# EAGLE schematic line-sensor-r2-var1a (EAGLE 9.3.1)
Assembly variants: I2C, USART, SPI

## Sheet 1 of 4
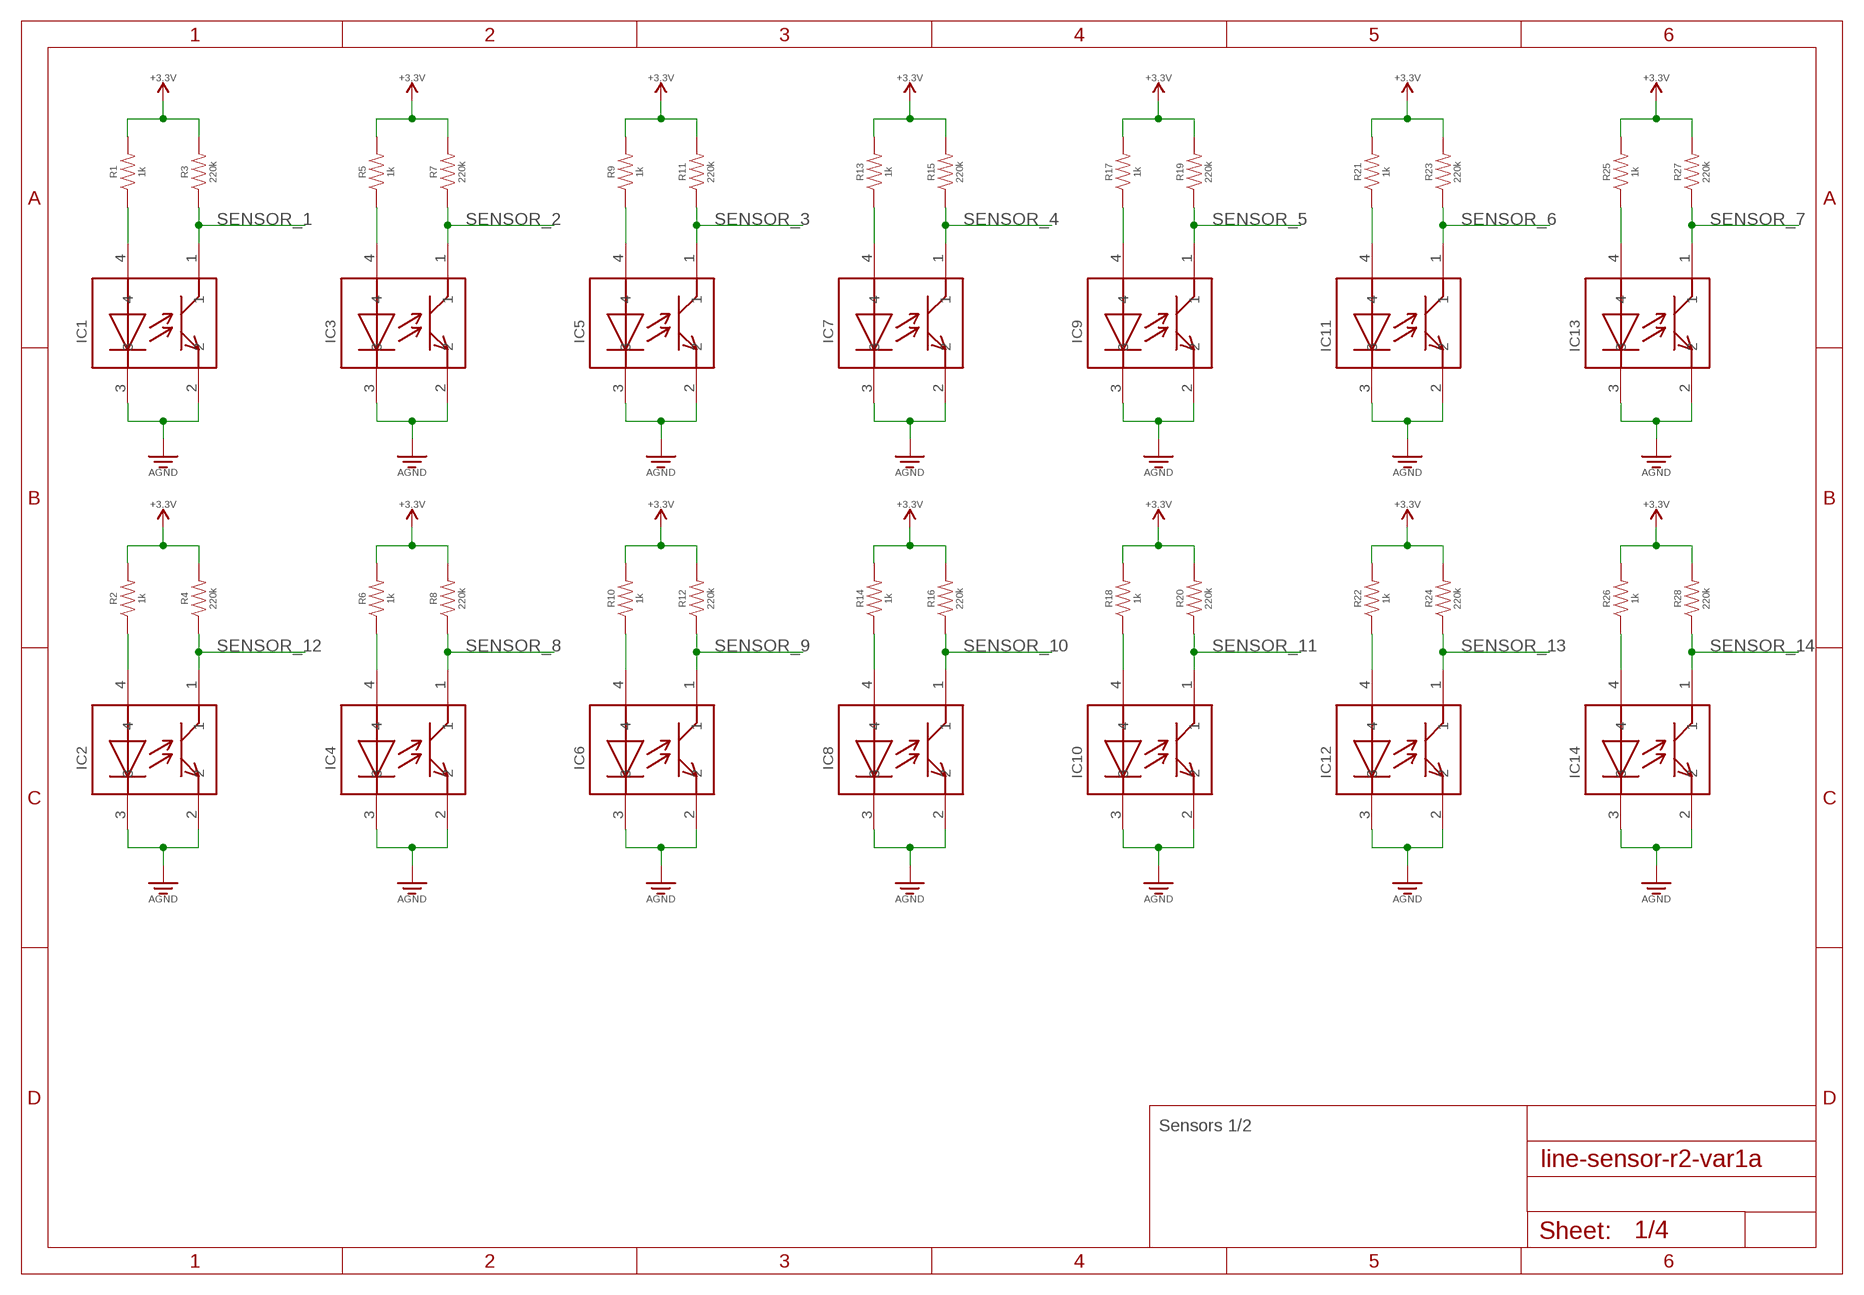
[diagram p0: schematic, sheet 1]

### Parts
IC1  GP2S60  [GP2S60]
IC2  GP2S60  [GP2S60]
IC3  GP2S60  [GP2S60]
IC4  GP2S60  [GP2S60]
IC5  GP2S60  [GP2S60]
IC6  GP2S60  [GP2S60]
IC7  GP2S60  [GP2S60]
IC8  GP2S60  [GP2S60]
IC9  GP2S60  [GP2S60]
IC10  GP2S60  [GP2S60]
IC11  GP2S60  [GP2S60]
IC12  GP2S60  [GP2S60]
IC13  GP2S60  [GP2S60]
IC14  GP2S60  [GP2S60]
R1  1k  RESISTOR_0.1W  [RESISTOR-0603]
R2  1k  RESISTOR_0.1W  [RESISTOR-0603]
R3  220k  RESISTOR_0.1W  [RESISTOR-0603]
R4  220k  RESISTOR_0.1W  [RESISTOR-0603]
R5  1k  RESISTOR_0.1W  [RESISTOR-0603]
R6  1k  RESISTOR_0.1W  [RESISTOR-0603]
R7  220k  RESISTOR_0.1W  [RESISTOR-0603]
R8  220k  RESISTOR_0.1W  [RESISTOR-0603]
R9  1k  RESISTOR_0.1W  [RESISTOR-0603]
R10  1k  RESISTOR_0.1W  [RESISTOR-0603]
R11  220k  RESISTOR_0.1W  [RESISTOR-0603]
R12  220k  RESISTOR_0.1W  [RESISTOR-0603]
R13  1k  RESISTOR_0.1W  [RESISTOR-0603]
R14  1k  RESISTOR_0.1W  [RESISTOR-0603]
R15  220k  RESISTOR_0.1W  [RESISTOR-0603]
R16  220k  RESISTOR_0.1W  [RESISTOR-0603]
R17  1k  RESISTOR_0.1W  [RESISTOR-0603]
R18  1k  RESISTOR_0.1W  [RESISTOR-0603]
R19  220k  RESISTOR_0.1W  [RESISTOR-0603]
R20  220k  RESISTOR_0.1W  [RESISTOR-0603]
R21  1k  RESISTOR_0.1W  [RESISTOR-0603]
R22  1k  RESISTOR_0.1W  [RESISTOR-0603]
R23  220k  RESISTOR_0.1W  [RESISTOR-0603]
R24  220k  RESISTOR_0.1W  [RESISTOR-0603]
R25  1k  RESISTOR_0.1W  [RESISTOR-0603]
R26  1k  RESISTOR_0.1W  [RESISTOR-0603]
R27  220k  RESISTOR_0.1W  [RESISTOR-0603]
R28  220k  RESISTOR_0.1W  [RESISTOR-0603]
SUPPLY1  +3.3V  (no package)
SUPPLY2  +3.3V  (no package)
SUPPLY3  +3.3V  (no package)
SUPPLY4  +3.3V  (no package)
SUPPLY5  +3.3V  (no package)
SUPPLY6  +3.3V  (no package)
SUPPLY7  +3.3V  (no package)
SUPPLY8  +3.3V  (no package)
SUPPLY9  +3.3V  (no package)
SUPPLY10  +3.3V  (no package)
SUPPLY11  +3.3V  (no package)
SUPPLY12  +3.3V  (no package)
SUPPLY13  +3.3V  (no package)
SUPPLY14  +3.3V  (no package)

### Nets
GND: IC1.2 IC1.3 IC2.2 IC2.3 IC3.2 IC3.3 IC4.2 IC4.3 IC5.2 IC5.3 IC6.2 IC6.3 IC7.2 IC7.3 IC8.2 IC8.3 IC9.2 IC9.3 IC10.2 IC10.3 IC11.2 IC11.3 IC12.2 IC12.3 IC13.2 IC13.3 IC14.2 IC14.3 ; supply symbol labelled AGND ; also sheet 2,3,4
N$1: IC3.4 R5.P$1
N$2: IC1.4 R1.P$1
N$3: IC5.4 R9.P$1
N$4: IC7.4 R13.P$1
N$5: IC9.4 R17.P$1
N$6: IC11.4 R21.P$1
N$7: IC13.4 R25.P$1
N$8: IC4.4 R6.P$1
N$9: IC6.4 R10.P$1
N$10: IC8.4 R14.P$1
N$11: IC10.4 R18.P$1
N$12: IC2.4 R2.P$1
N$13: IC12.4 R22.P$1
N$14: IC14.4 R26.P$1
SENSOR_1: IC1.1 R3.P$1 ; also sheet 3
SENSOR_2: IC3.1 R7.P$1 ; also sheet 3
SENSOR_3: IC5.1 R11.P$1 ; also sheet 3
SENSOR_4: IC7.1 R15.P$1 ; also sheet 3
SENSOR_5: IC9.1 R19.P$1 ; also sheet 3
SENSOR_6: IC11.1 R23.P$1 ; also sheet 3
SENSOR_7: IC13.1 R27.P$1 ; also sheet 3
SENSOR_8: IC4.1 R8.P$1 ; also sheet 3
SENSOR_9: IC6.1 R12.P$1 ; also sheet 3
SENSOR_10: IC8.1 R16.P$1 ; also sheet 3
SENSOR_11: IC10.1 R20.P$1 ; also sheet 3
SENSOR_12: IC2.1 R4.P$1 ; also sheet 3
SENSOR_13: IC12.1 R24.P$1 ; also sheet 3
SENSOR_14: IC14.1 R28.P$1 ; also sheet 3
VDD: R1.P$2 R2.P$2 R3.P$2 R4.P$2 R5.P$2 R6.P$2 R7.P$2 R8.P$2 R9.P$2 R10.P$2 R11.P$2 R12.P$2 R13.P$2 R14.P$2 R15.P$2 R16.P$2 R17.P$2 R18.P$2 R19.P$2 R20.P$2 R21.P$2 R22.P$2 R23.P$2 R24.P$2 R25.P$2 R26.P$2 R27.P$2 R28.P$2 SUPPLY1.VCC SUPPLY2.VCC SUPPLY3.VCC SUPPLY4.VCC SUPPLY5.VCC SUPPLY6.VCC SUPPLY7.VCC SUPPLY8.VCC SUPPLY9.VCC SUPPLY10.VCC SUPPLY11.VCC SUPPLY12.VCC SUPPLY13.VCC SUPPLY14.VCC ; also sheet 2,3,4

### Notes on the sheet
- Sensors 1/2

## Sheet 2 of 4
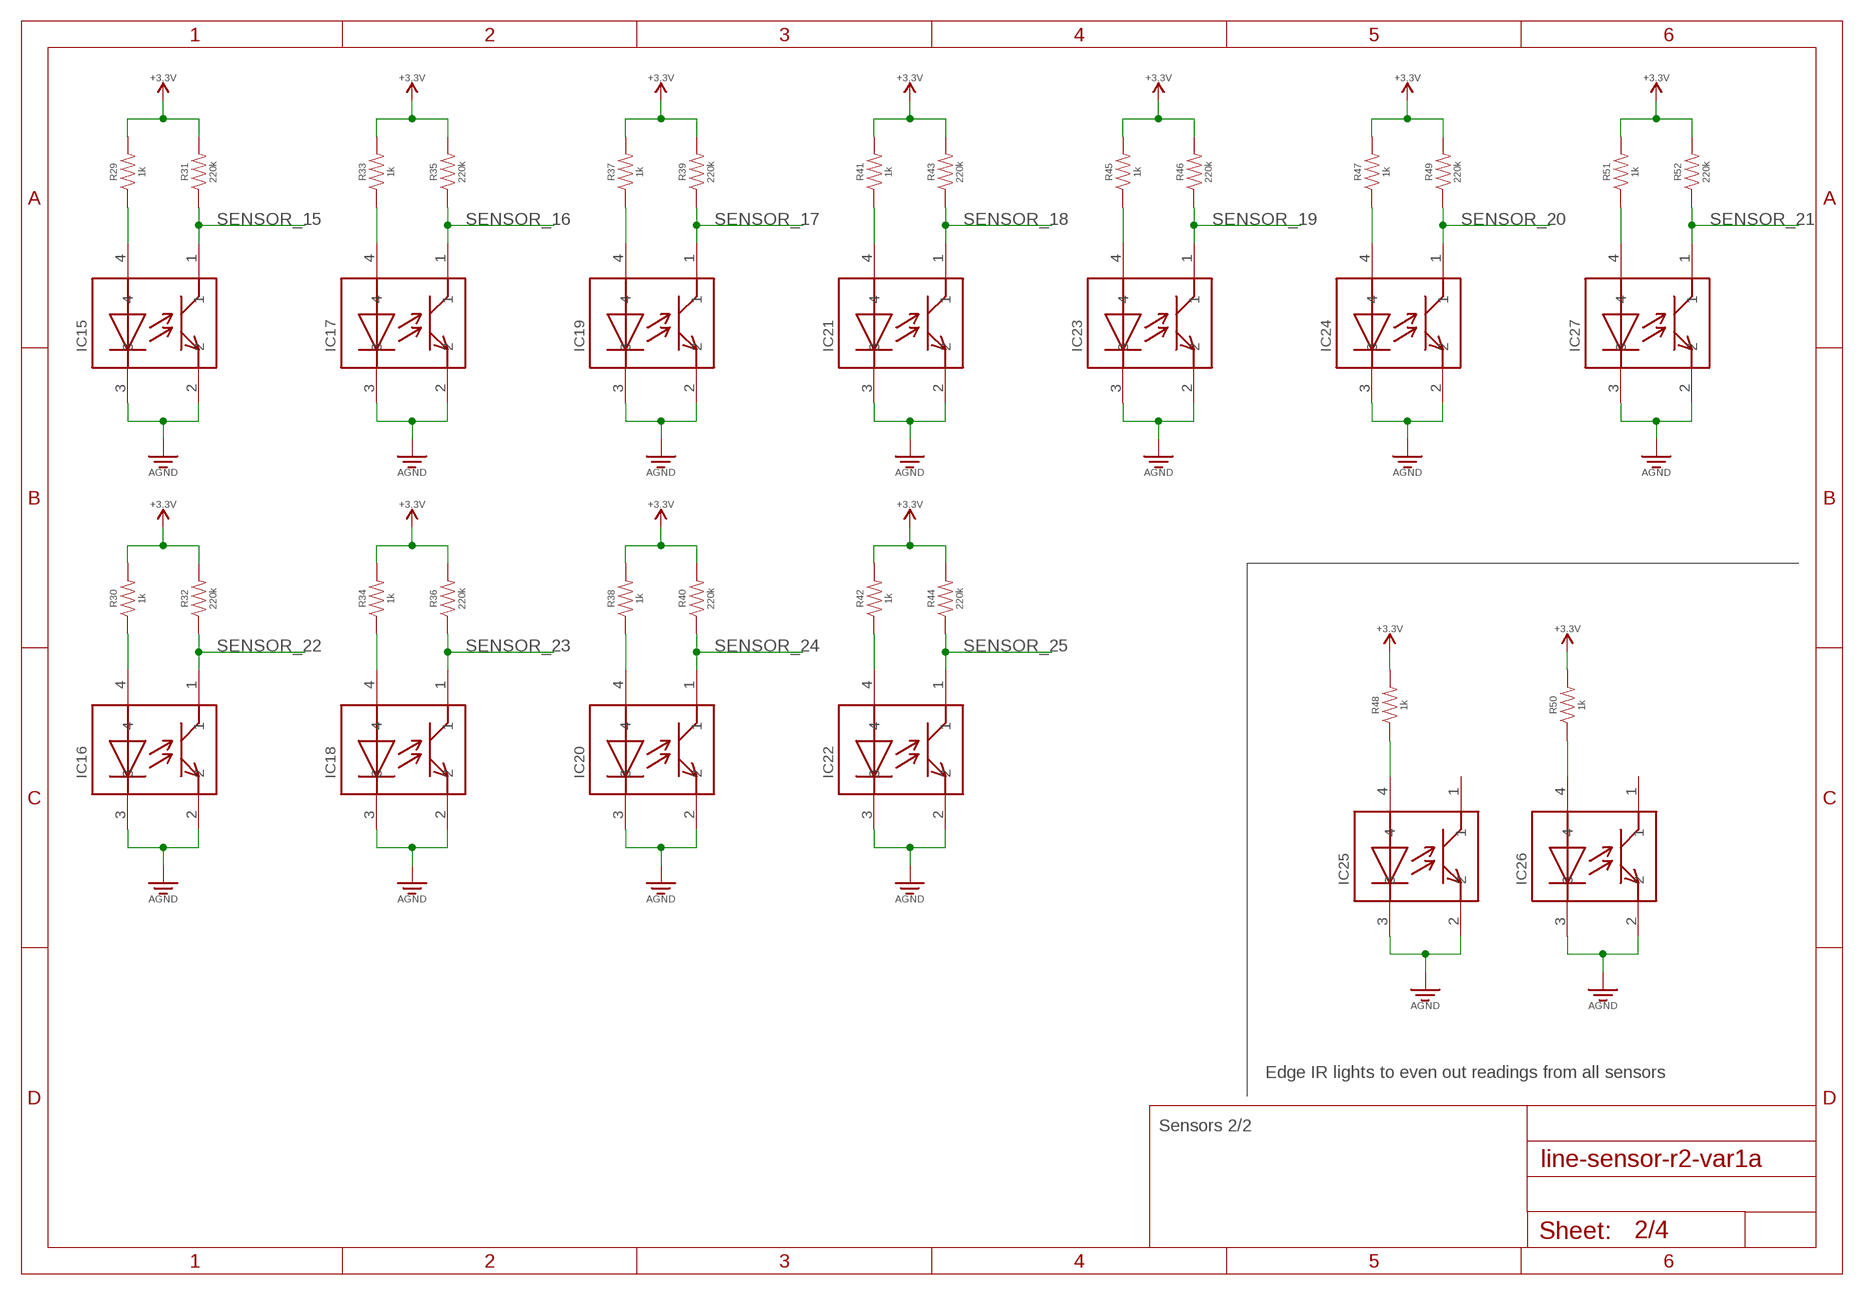
[diagram p1: schematic, sheet 2]

### Parts
IC15  GP2S60  [GP2S60]
IC16  GP2S60  [GP2S60]
IC17  GP2S60  [GP2S60]
IC18  GP2S60  [GP2S60]
IC19  GP2S60  [GP2S60]
IC20  GP2S60  [GP2S60]
IC21  GP2S60  [GP2S60]
IC22  GP2S60  [GP2S60]
IC23  GP2S60  [GP2S60]
IC24  GP2S60  [GP2S60]
IC25  GP2S60  [GP2S60]
IC26  GP2S60  [GP2S60]
IC27  GP2S60  [GP2S60]
R29  1k  RESISTOR_0.1W  [RESISTOR-0603]
R30  1k  RESISTOR_0.1W  [RESISTOR-0603]
R31  220k  RESISTOR_0.1W  [RESISTOR-0603]
R32  220k  RESISTOR_0.1W  [RESISTOR-0603]
R33  1k  RESISTOR_0.1W  [RESISTOR-0603]
R34  1k  RESISTOR_0.1W  [RESISTOR-0603]
R35  220k  RESISTOR_0.1W  [RESISTOR-0603]
R36  220k  RESISTOR_0.1W  [RESISTOR-0603]
R37  1k  RESISTOR_0.1W  [RESISTOR-0603]
R38  1k  RESISTOR_0.1W  [RESISTOR-0603]
R39  220k  RESISTOR_0.1W  [RESISTOR-0603]
R40  220k  RESISTOR_0.1W  [RESISTOR-0603]
R41  1k  RESISTOR_0.1W  [RESISTOR-0603]
R42  1k  RESISTOR_0.1W  [RESISTOR-0603]
R43  220k  RESISTOR_0.1W  [RESISTOR-0603]
R44  220k  RESISTOR_0.1W  [RESISTOR-0603]
R45  1k  RESISTOR_0.1W  [RESISTOR-0603]
R46  220k  RESISTOR_0.1W  [RESISTOR-0603]
R47  1k  RESISTOR_0.1W  [RESISTOR-0603]
R48  1k  RESISTOR_0.1W  [RESISTOR-0603]
R49  220k  RESISTOR_0.1W  [RESISTOR-0603]
R50  1k  RESISTOR_0.1W  [RESISTOR-0603]
R51  1k  RESISTOR_0.1W  [RESISTOR-0603]
R52  220k  RESISTOR_0.1W  [RESISTOR-0603]
SUPPLY15  +3.3V  (no package)
SUPPLY16  +3.3V  (no package)
SUPPLY17  +3.3V  (no package)
SUPPLY18  +3.3V  (no package)
SUPPLY19  +3.3V  (no package)
SUPPLY20  +3.3V  (no package)
SUPPLY21  +3.3V  (no package)
SUPPLY22  +3.3V  (no package)
SUPPLY23  +3.3V  (no package)
SUPPLY24  +3.3V  (no package)
SUPPLY25  +3.3V  (no package)
SUPPLY26  +3.3V  (no package)
SUPPLY27  +3.3V  (no package)

### Nets
GND: IC15.2 IC15.3 IC16.2 IC16.3 IC17.2 IC17.3 IC18.2 IC18.3 IC19.2 IC19.3 IC20.2 IC20.3 IC21.2 IC21.3 IC22.2 IC22.3 IC23.2 IC23.3 IC24.2 IC24.3 IC25.2 IC25.3 IC26.2 IC26.3 IC27.2 IC27.3 ; supply symbol labelled AGND ; also sheet 1,3,4
N$15: IC15.4 R29.P$1
N$16: IC17.4 R33.P$1
N$17: IC19.4 R37.P$1
N$18: IC21.4 R41.P$1
N$19: IC23.4 R45.P$1
N$20: IC24.4 R47.P$1
N$21: IC27.4 R51.P$1
N$22: IC16.4 R30.P$1
N$23: IC18.4 R34.P$1
N$24: IC20.4 R38.P$1
N$25: IC22.4 R42.P$1
N$30: IC26.4 R50.P$1
N$31: IC25.4 R48.P$1
SENSOR_15: IC15.1 R31.P$1 ; also sheet 3
SENSOR_16: IC17.1 R35.P$1 ; also sheet 3
SENSOR_17: IC19.1 R39.P$1 ; also sheet 3
SENSOR_18: IC21.1 R43.P$1 ; also sheet 3
SENSOR_19: IC23.1 R46.P$1 ; also sheet 3
SENSOR_20: IC24.1 R49.P$1 ; also sheet 3
SENSOR_21: IC27.1 R52.P$1 ; also sheet 3
SENSOR_22: IC16.1 R32.P$1 ; also sheet 3
SENSOR_23: IC18.1 R36.P$1 ; also sheet 3
SENSOR_24: IC20.1 R40.P$1 ; also sheet 3
SENSOR_25: IC22.1 R44.P$1 ; also sheet 3
VDD: R29.P$2 R30.P$2 R31.P$2 R32.P$2 R33.P$2 R34.P$2 R35.P$2 R36.P$2 R37.P$2 R38.P$2 R39.P$2 R40.P$2 R41.P$2 R42.P$2 R43.P$2 R44.P$2 R45.P$2 R46.P$2 R47.P$2 R48.P$2 R49.P$2 R50.P$2 R51.P$2 R52.P$2 SUPPLY15.VCC SUPPLY16.VCC SUPPLY17.VCC SUPPLY18.VCC SUPPLY19.VCC SUPPLY20.VCC SUPPLY21.VCC SUPPLY22.VCC SUPPLY23.VCC SUPPLY24.VCC SUPPLY25.VCC SUPPLY26.VCC SUPPLY27.VCC ; also sheet 1,3,4
Unconnected: IC25.1 IC26.1

### Notes on the sheet
- Edge IR lights to even out readings from all sensors
- Sensors 2/2

## Sheet 3 of 4
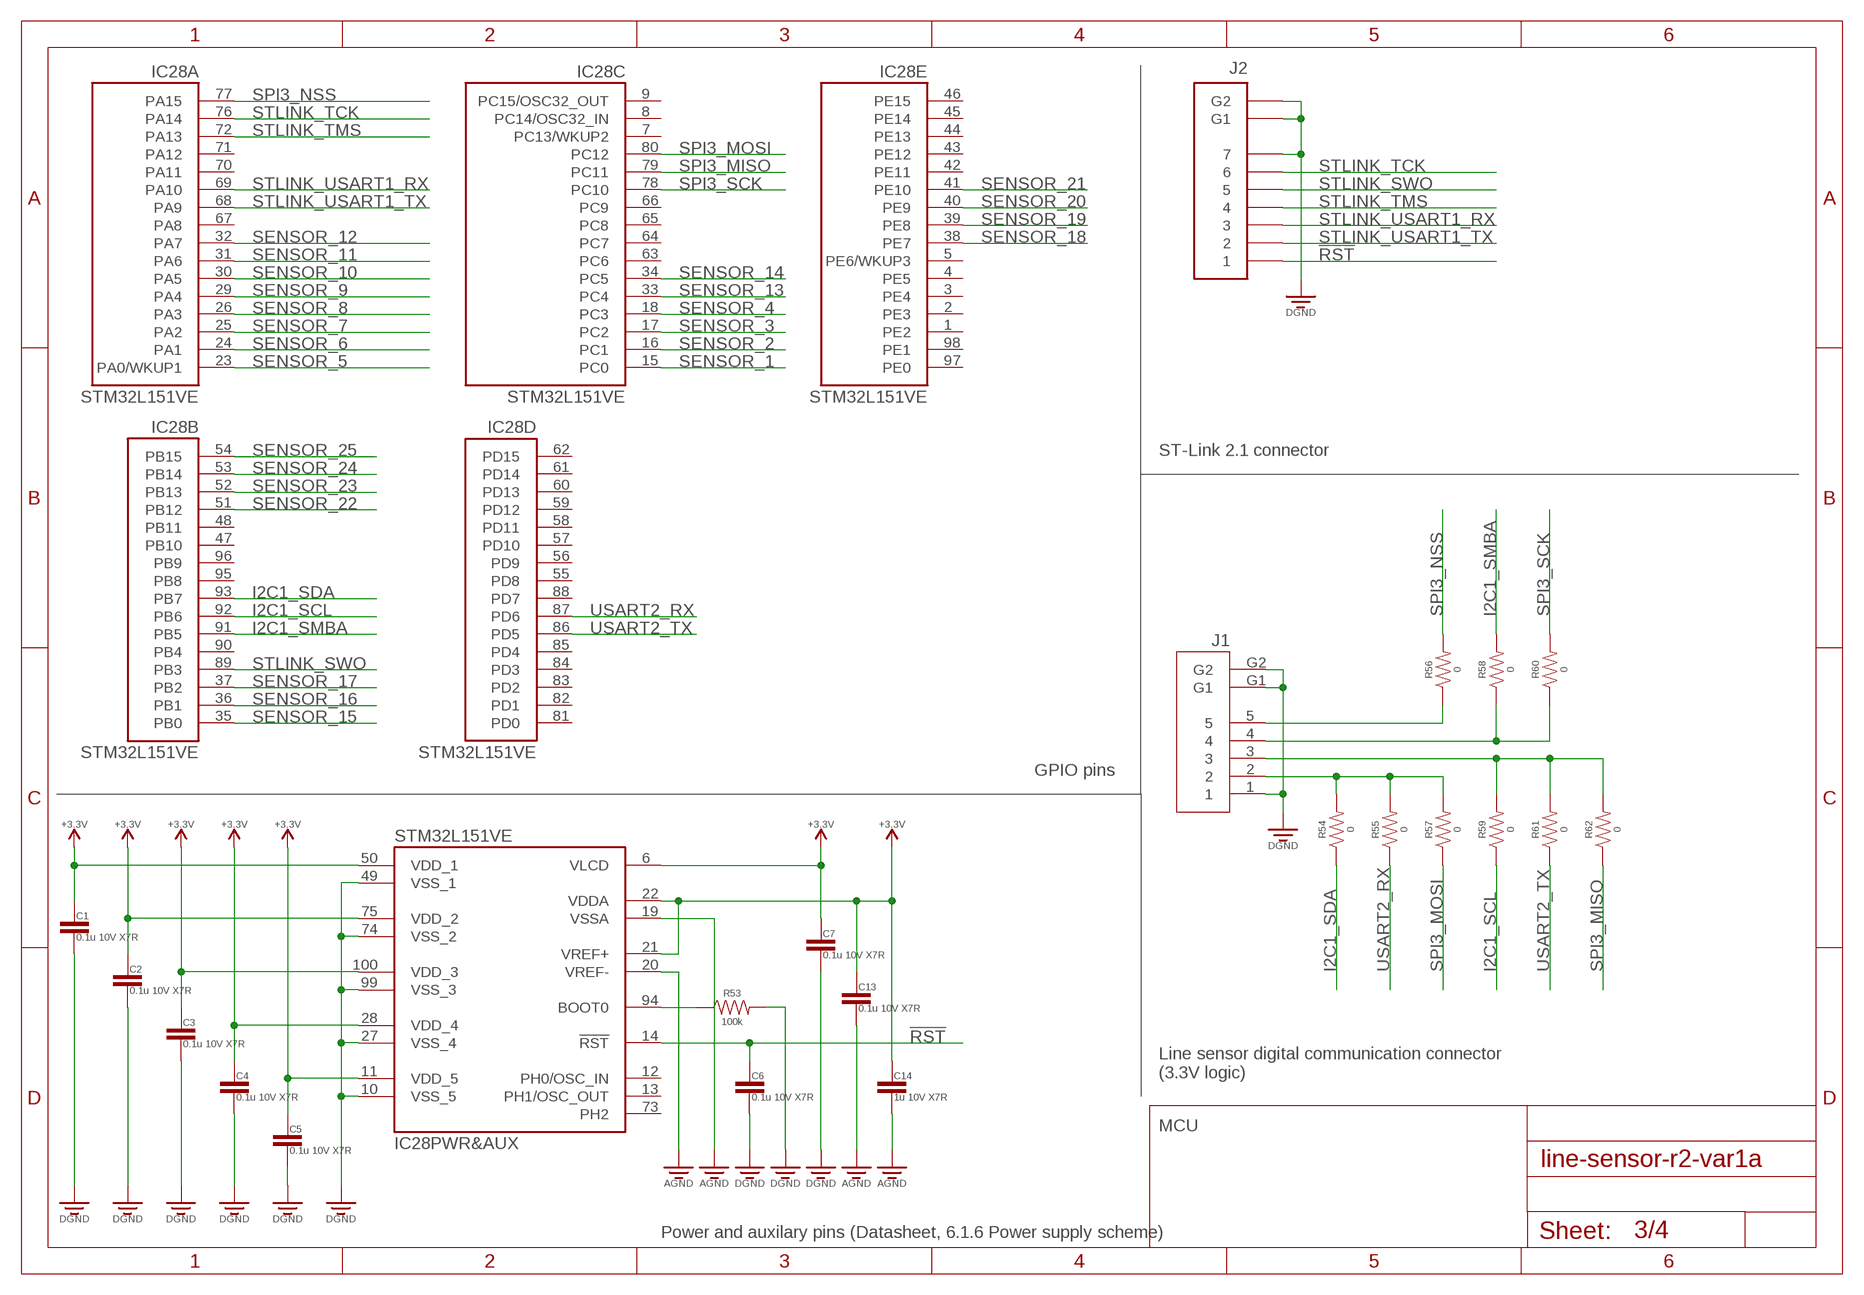
[diagram p2: schematic, sheet 3]

### Parts
C1  0.1u 10V X7R  CAPACITOR0603  [CAPACITOR-0603]
C2  0.1u 10V X7R  CAPACITOR0603  [CAPACITOR-0603]
C3  0.1u 10V X7R  CAPACITOR0603  [CAPACITOR-0603]
C4  0.1u 10V X7R  CAPACITOR0603  [CAPACITOR-0603]
C5  0.1u 10V X7R  CAPACITOR0603  [CAPACITOR-0603]
C6  0.1u 10V X7R  CAPACITOR0603  [CAPACITOR-0603]
C7  0.1u 10V X7R  CAPACITOR0603  [CAPACITOR-0603]
C13  0.1u 10V X7R  CAPACITOR0603  [CAPACITOR-0603]
C14  1u 10V X7R  CAPACITOR0603  [CAPACITOR-0603]
IC28  STM32L151VE  [LQFP100_14X14]
J1  MOLEX-502382-05XX  [MOLEX-502382-05XX]
J2  MOLEX-53261-0771  [MOLEX-53261-0771]
R53  100k  RESISTOR_0.1W  [RESISTOR-0603]
R54  0  RESISTOR_0.1W  [RESISTOR-0603]  (not fitted in variant USART)  (not fitted in variant SPI)
R55  0  RESISTOR_0.1W  [RESISTOR-0603]  (not fitted in variant I2C)  (not fitted in variant SPI)
R56  0  RESISTOR_0.1W  [RESISTOR-0603]  (not fitted in variant I2C)  (not fitted in variant USART)
R57  0  RESISTOR_0.1W  [RESISTOR-0603]  (not fitted in variant I2C)  (not fitted in variant USART)
R58  0  RESISTOR_0.1W  [RESISTOR-0603]  (not fitted in variant USART)  (not fitted in variant SPI)
R59  0  RESISTOR_0.1W  [RESISTOR-0603]  (not fitted in variant USART)  (not fitted in variant SPI)
R60  0  RESISTOR_0.1W  [RESISTOR-0603]  (not fitted in variant I2C)  (not fitted in variant USART)
R61  0  RESISTOR_0.1W  [RESISTOR-0603]  (not fitted in variant I2C)  (not fitted in variant SPI)
R62  0  RESISTOR_0.1W  [RESISTOR-0603]  (not fitted in variant I2C)  (not fitted in variant USART)
SUPPLY28  +3.3V  (no package)
SUPPLY29  +3.3V  (no package)
SUPPLY30  +3.3V  (no package)
SUPPLY31  +3.3V  (no package)
SUPPLY32  +3.3V  (no package)
SUPPLY33  +3.3V  (no package)
SUPPLY37  +3.3V  (no package)

### Nets
!RST: C6.1 IC28.14(PWR&AUX:!RST!) J2.1
BOOT0: IC28.94(PWR&AUX:BOOT0) R53.P$1
GND: C1.2 C2.2 C3.2 C4.2 C5.2 C6.2 C7.2 C13.2 C14.2 IC28.10(PWR&AUX:VSS_5) IC28.19(PWR&AUX:VSSA) IC28.20(PWR&AUX:VREF-) IC28.27(PWR&AUX:VSS_4) IC28.49(PWR&AUX:VSS_1) IC28.74(PWR&AUX:VSS_2) IC28.99(PWR&AUX:VSS_3) J1.1 J1.G1 J1.G2 J2.7 J2.G1 J2.G2 R53.P$2 ; supply symbol labelled DGND, AGND ; also sheet 1,2,4
I2C1_SCL: IC28.92(B:PB6) R59.P$1
I2C1_SDA: IC28.93(B:PB7) R54.P$1
I2C1_SMBA: IC28.91(B:PB5) R58.P$2
N$26: J1.2 R54.P$2 R55.P$2 R57.P$2
N$27: J1.3 R59.P$2 R61.P$2 R62.P$2
N$28: J1.4 R58.P$1 R60.P$1
N$29: J1.5 R56.P$1
SENSOR_1: IC28.15(C:PC0) ; also sheet 1
SENSOR_2: IC28.16(C:PC1) ; also sheet 1
SENSOR_3: IC28.17(C:PC2) ; also sheet 1
SENSOR_4: IC28.18(C:PC3) ; also sheet 1
SENSOR_5: IC28.23(A:PA0/WKUP1) ; also sheet 1
SENSOR_6: IC28.24(A:PA1) ; also sheet 1
SENSOR_7: IC28.25(A:PA2) ; also sheet 1
SENSOR_8: IC28.26(A:PA3) ; also sheet 1
SENSOR_9: IC28.29(A:PA4) ; also sheet 1
SENSOR_10: IC28.30(A:PA5) ; also sheet 1
SENSOR_11: IC28.31(A:PA6) ; also sheet 1
SENSOR_12: IC28.32(A:PA7) ; also sheet 1
SENSOR_13: IC28.33(C:PC4) ; also sheet 1
SENSOR_14: IC28.34(C:PC5) ; also sheet 1
SENSOR_15: IC28.35(B:PB0) ; also sheet 2
SENSOR_16: IC28.36(B:PB1) ; also sheet 2
SENSOR_17: IC28.37(B:PB2) ; also sheet 2
SENSOR_18: IC28.38(E:PE7) ; also sheet 2
SENSOR_19: IC28.39(E:PE8) ; also sheet 2
SENSOR_20: IC28.40(E:PE9) ; also sheet 2
SENSOR_21: IC28.41(E:PE10) ; also sheet 2
SENSOR_22: IC28.51(B:PB12) ; also sheet 2
SENSOR_23: IC28.52(B:PB13) ; also sheet 2
SENSOR_24: IC28.53(B:PB14) ; also sheet 2
SENSOR_25: IC28.54(B:PB15) ; also sheet 2
SPI3_MISO: IC28.79(C:PC11) R62.P$1
SPI3_MOSI: IC28.80(C:PC12) R57.P$1
SPI3_NSS: IC28.77(A:PA15) R56.P$2
SPI3_SCK: IC28.78(C:PC10) R60.P$2
STLINK_SWO: IC28.89(B:PB3) J2.5
STLINK_TCK: IC28.76(A:PA14) J2.6
STLINK_TMS: IC28.72(A:PA13) J2.4
STLINK_USART1_RX: IC28.69(A:PA10) J2.3
STLINK_USART1_TX: IC28.68(A:PA9) J2.2
USART2_RX: IC28.87(D:PD6) R55.P$1
USART2_TX: IC28.86(D:PD5) R61.P$1
VDD: C1.1 C2.1 C3.1 C4.1 C5.1 C7.1 C13.1 C14.1 IC28.6(PWR&AUX:VLCD) IC28.11(PWR&AUX:VDD_5) IC28.21(PWR&AUX:VREF+) IC28.22(PWR&AUX:VDDA) IC28.28(PWR&AUX:VDD_4) IC28.50(PWR&AUX:VDD_1) IC28.75(PWR&AUX:VDD_2) IC28.100(PWR&AUX:VDD_3) SUPPLY28.VCC SUPPLY29.VCC SUPPLY30.VCC SUPPLY31.VCC SUPPLY32.VCC SUPPLY33.VCC SUPPLY37.VCC ; also sheet 1,2,4
Unconnected: IC28.1(E:PE2) IC28.2(E:PE3) IC28.3(E:PE4) IC28.4(E:PE5) IC28.5(E:PE6/WKUP3) IC28.7(C:PC13/WKUP2) IC28.8(C:PC14/OSC32_IN) IC28.9(C:PC15/OSC32_OUT) IC28.12(PWR&AUX:PH0/OSC_IN) IC28.13(PWR&AUX:PH1/OSC_OUT) IC28.42(E:PE11) IC28.43(E:PE12) IC28.44(E:PE13) IC28.45(E:PE14) IC28.46(E:PE15) IC28.47(B:PB10) IC28.48(B:PB11) IC28.55(D:PD8) IC28.56(D:PD9) IC28.57(D:PD10) IC28.58(D:PD11) IC28.59(D:PD12) IC28.60(D:PD13) IC28.61(D:PD14) IC28.62(D:PD15) IC28.63(C:PC6) IC28.64(C:PC7) IC28.65(C:PC8) IC28.66(C:PC9) IC28.67(A:PA8) IC28.70(A:PA11) IC28.71(A:PA12) IC28.73(PWR&AUX:PH2) IC28.81(D:PD0) IC28.82(D:PD1) IC28.83(D:PD2) IC28.84(D:PD3) IC28.85(D:PD4) IC28.88(D:PD7) IC28.90(B:PB4) IC28.95(B:PB8) IC28.96(B:PB9) IC28.97(E:PE0) IC28.98(E:PE1)

### Notes on the sheet
- ST-Link 2.1 connector
- GPIO pins
- Line sensor digital communication connector
  (3.3V logic)
- MCU
- Power and auxilary pins (Datasheet, 6.1.6 Power supply scheme)

## Sheet 4 of 4
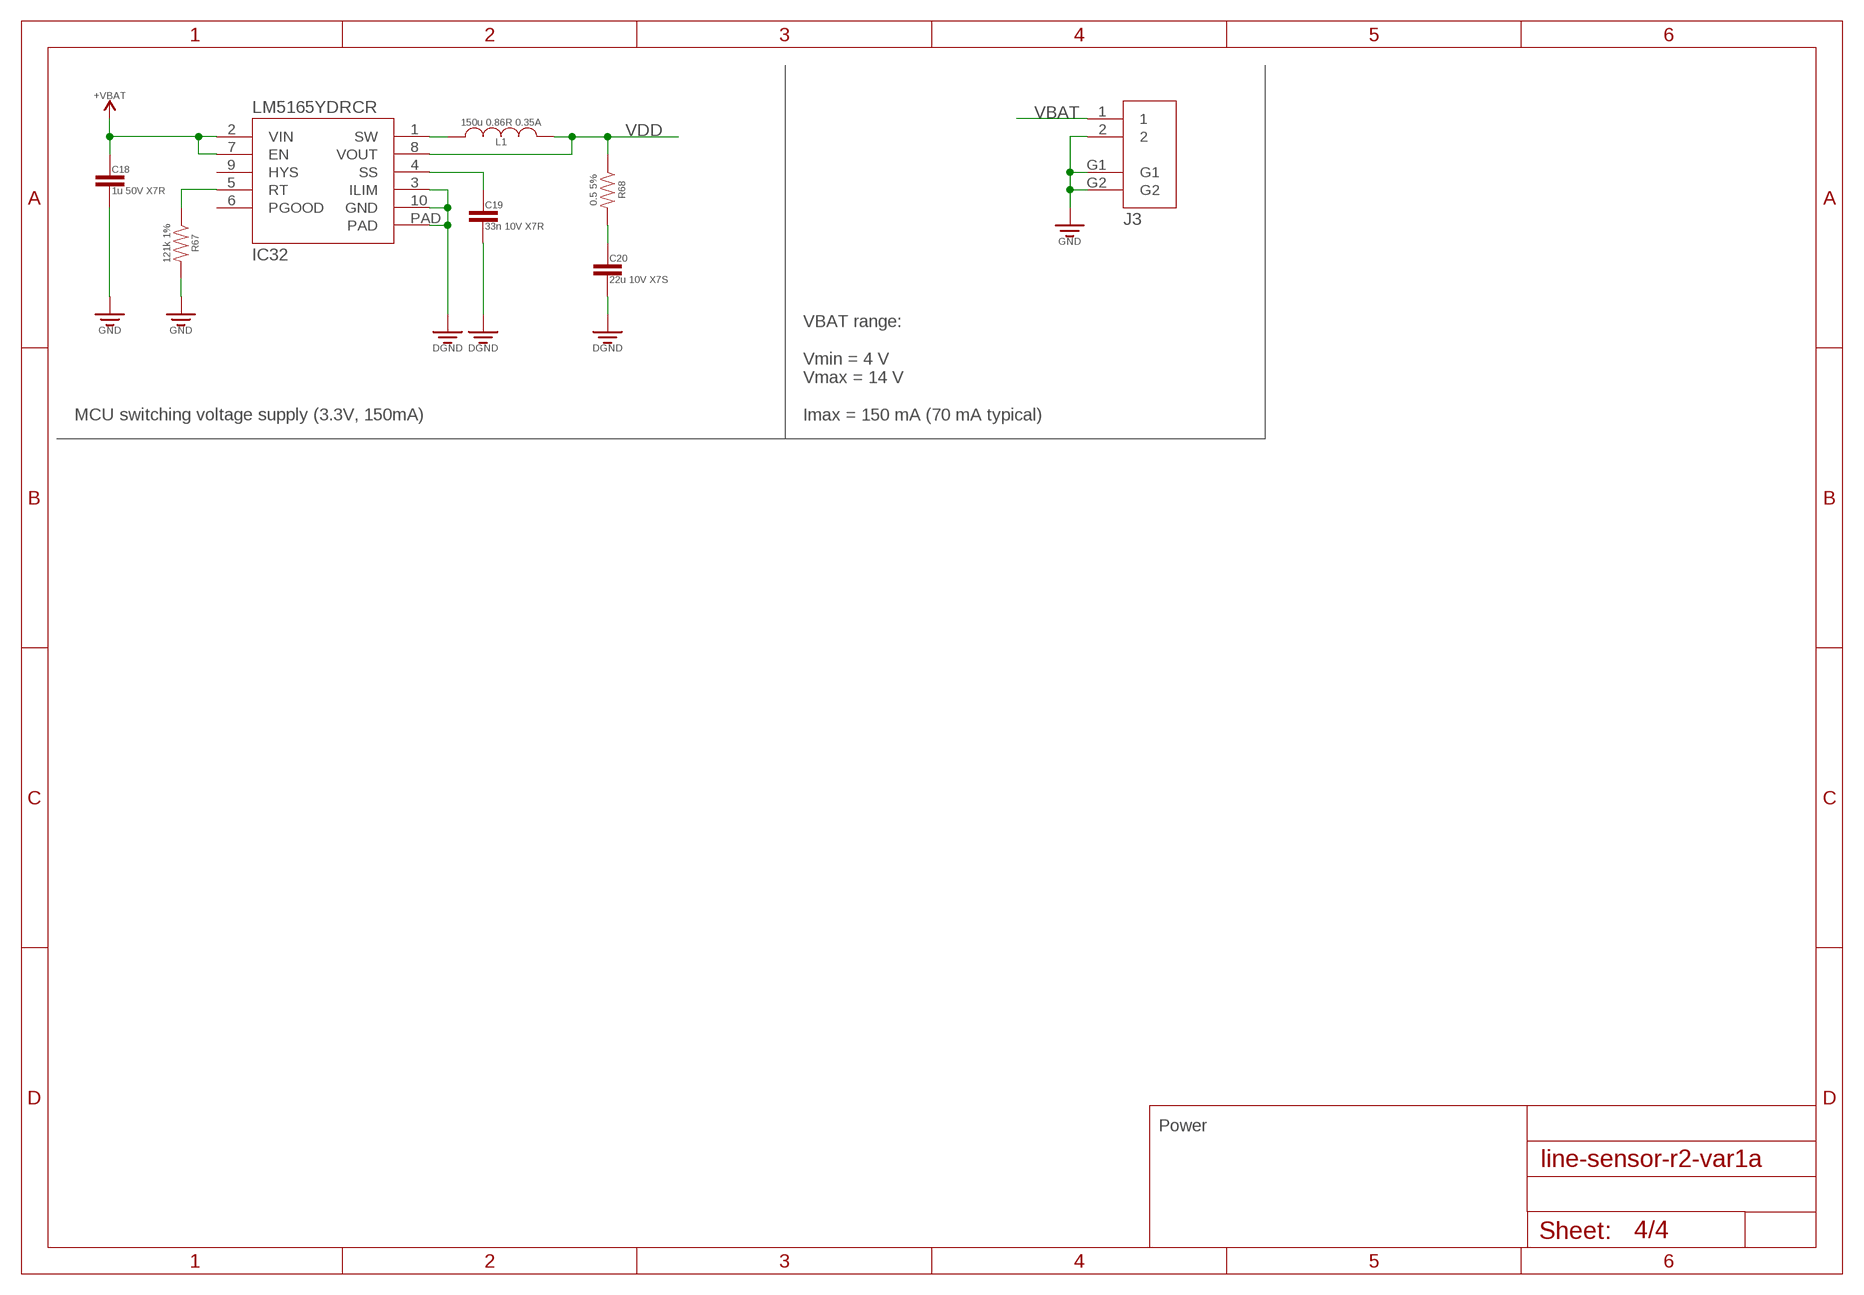
[diagram p3: schematic, sheet 4]

### Parts
C18  1u 50V X7R  CAPACITOR1206  [CAPACITOR-1206]
C19  33n 10V X7R  CAPACITOR0603  [CAPACITOR-0603]
C20  22u 10V X7S  CAPACITOR0805  [CAPACITOR-0805]
IC32  LM5165YDRCR  [VSON-10-0.5MM]
J3  MOLEX-502382-02XX  [MOLEX-502382-02XX]
L1  150u 0.86R 0.35A  INDUCTORPANASONIC-SERIES-H  [PANASONIC-SERIES-H]
R67  121k 1%  RESISTOR0603  [RESISTOR-0603]
R68  0.5 5%  RESISTOR0603  [RESISTOR-0603]
SUPPLY35  +VBAT  (no package)

### Nets
GND: C18.P$2 C19.2 C20.2 IC32.3(ILIM) IC32.10(GND) IC32.PAD J3.2 J3.G1 J3.G2 R67.P$2 ; supply symbol labelled DGND ; also sheet 1,2,3
IC32_SW: IC32.1(SW) L1.1
N$35: IC32.5(RT) R67.P$1
N$40: C19.1 IC32.4(SS)
N$42: C20.1 R68.P$2
VBAT: C18.P$1 IC32.2(VIN) IC32.7(EN) J3.1 SUPPLY35.VCC
VDD: IC32.8(VOUT) L1.2 R68.P$1 ; also sheet 1,2,3
Unconnected: IC32.6(PGOOD) IC32.9(HYS)

### Notes on the sheet
- MCU switching voltage supply (3.3V, 150mA)
- VBAT range:
  
  Vmin = 4 V
  Vmax = 14 V
  
  Imax = 150 mA (70 mA typical)
- Power

## Library data of the parts
C1-C7 C13 C14 = capacitors:CAPACITOR
C18-C20 = passives:CAPACITOR
IC1-IC27 = sensors:GP2S60: SMT Compact Reﬂective Photointerrupter Datasheet: http://www.sharp-world.com/products/device/lineup/data/pdf/datasheet/gp2s60_e.pdf
IC28 = mcu:STM32L151VE
IC32 = voltage-regulator:LM5165YDRCR: Texas Instruments V in: 3...65 V V out: 3.3 V I out: 150 mA Frequency: <= 600kHz
J1 = connectors:MOLEX-502382-05XX
J2 = connectors:MOLEX-53261-0771
J3 = connectors:MOLEX-502382-02XX
L1 = passives:INDUCTOR
R1-R62 = resistors:RESISTOR_0.1W
R67 R68 = passives:RESISTOR
SUPPLY1-SUPPLY33 SUPPLY37 = voltage-ground:+3.3V: +3.3V Voltage Supply Positive voltage supply (traditionally for a BJT device, C=collector).
SUPPLY35 = voltage-ground:+VBAT: +3.3V Voltage Supply Positive voltage supply (traditionally for a BJT device, C=collector).

## Net classes
1 ground: width 0.3 mm
2 3v3: width 0.3 mm